# EAGLE design PowerManagementMysensors (EAGLE 6.5.0)
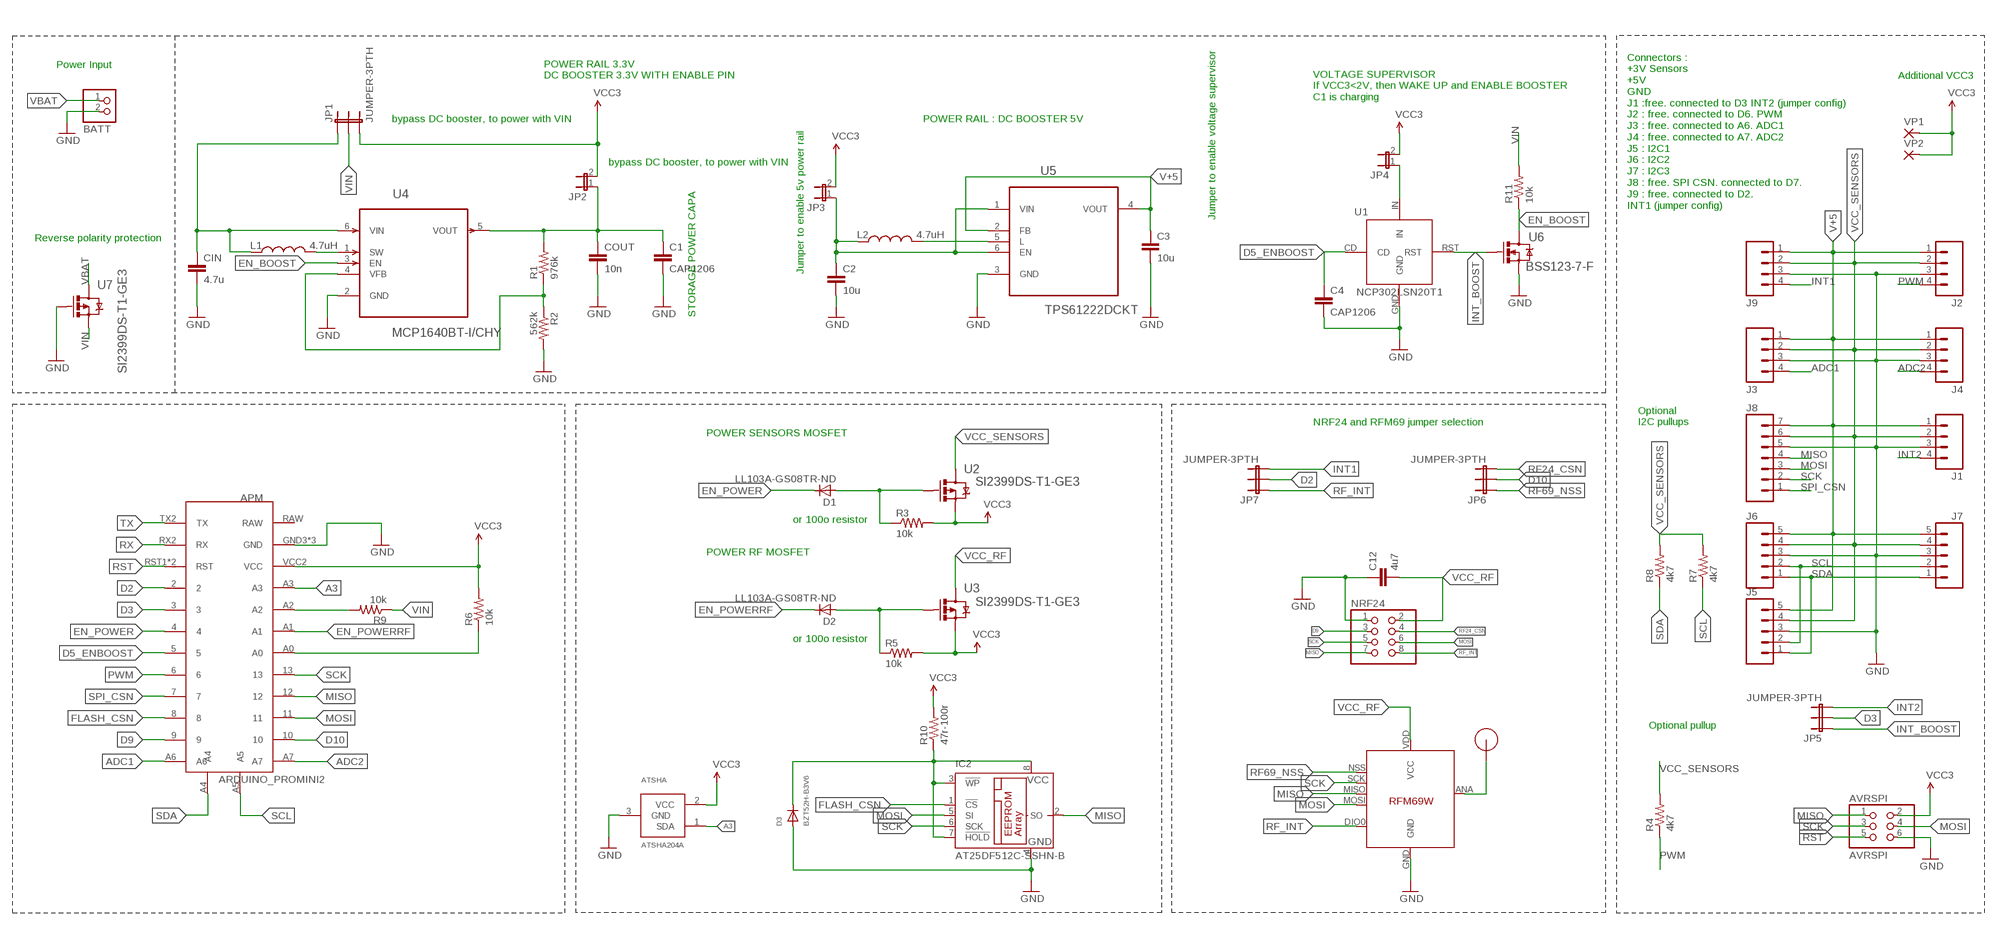
[diagram p0: schematic, sheet 1]

## Parts
ANT  RFM12B_ANTENNA  [RFM12B-ANTENNA]
APM  ARDUINO_PROMINI2  [ARDUINO_PROMINI2]
ATSHA  ATSHA204A  [SOT23]
AVRSPI  AVRSPI  PINHD-2X3  [2X03]
BATT  JST_2PIN-THM  [JST-PH-2-THM]
C1  CAP1206  [CAP1206]
C2  10u  CAP1206  [CAP1206]
C3  10u  CAP1206  [CAP1206]
C4  CAP1206  [CAP1206]
C12  4u7  CAP1206  [CAP1206]
CIN  4.7u  CAP1206  [CAP1206]
COUT  10n  CAP1206  [CAP1206]
D1  LL103A-GS08TR-ND  D-SOD-80  [SOD80]
D2  LL103A-GS08TR-ND  D-SOD-80  [SOD80]
D3  BZT52H-B3V6  DIODESOD-123  [SOD-123]
IC2  AT25DF512C-SSHN-B  25AA080SN  [SO-08]
J1  M041X04_NO_SILK  [1X04_NO_SILK]
J2  M041X04_NO_SILK  [1X04_NO_SILK]
J3  M041X04_NO_SILK  [1X04_NO_SILK]
J4  M041X04_NO_SILK  [1X04_NO_SILK]
J5  M05NO_SILK  [1X05_NO_SILK]
J6  M05NO_SILK  [1X05_NO_SILK]
J7  M05NO_SILK  [1X05_NO_SILK]
J8  M07  [1X07]
J9  M041X04_NO_SILK  [1X04_NO_SILK]
JP1  JUMPER-3PTH  [1X03]
JP2  JUMPER-2PTH  [1X02]
JP3  JUMPER-2PTH  [1X02]
JP4  JUMPER-2PTH  [1X02]
JP5  JUMPER-3PTH  [1X03]
JP6  JUMPER-3PTH  [1X03]
JP7  JUMPER-3PTH  [1X03]
L1  4.7uH  INDUCTOR0805  [0805]
L2  4.7uH  INDUCTOR0805  [0805]
NRF24  PINHD-2X4  [2X04]
R1  976k  RESISTOR1206  [1206]
R2  562k  RESISTOR1206  [1206]
R3  10k  RESISTOR1206  [1206]
R4  4k7  RESISTOR1206  [1206]
R5  10k  RESISTOR1206  [1206]
R6  10k  RESISTOR1206  [1206]
R7  4k7  RESISTOR1206  [1206]
R8  4k7  RESISTOR1206  [1206]
R9  10k  RESISTOR1206  [1206]
R10  47r-100r  RESISTOR1206  [1206]
R11  10k  RESISTOR1206  [1206]
RFM69  RFM69  [RFM69W-MINPADS]
U1  NCP302LSN20T1  [NCP302LSN20T1]
U2  SI2399DS-T1-GE3  [SOT95P237X112-3N]
U3  SI2399DS-T1-GE3  [SOT95P237X112-3N]
U4  MCP1640BT-I/CHY  [SOT95P270X145-6N]
U5  TPS61222DCKT  [SOT65P210X110-6N]
U6  BSS123-7-F  [SOT95P240X110-3N]
U7  SI2399DS-T1-GE3  [SOT95P237X112-3N]
VP1  1,6/0,9  [1,6/0,9]
VP2  1,6/0,9  [1,6/0,9]

## Nets
A3: APM.A3 ATSHA.1(SDA)
ADC1: APM.A6 J3.4
ADC2: APM.A7 J4.4
D2: APM.2 JP7.2
D3: APM.3 JP5.2
D5_ENBOOST: APM.5 C4.1 U1.CD
D9: APM.9 NRF24.3
D10: APM.10 JP6.2
EN_BOOST: R11.1 U4.3(EN) U6.3(D)
EN_POWER: APM.4 D1.1(C)
EN_POWERRF: APM.A1 D2.1(C)
FLASH_CSN: APM.8 IC2.1(!CS)
GND: APM.GND3(GND) APM.GND4(GND) APM.GND5(GND) ATSHA.3(GND) AVRSPI.6 BATT.2 C1.2 C2.2 C3.2 C4.2 C12.1 CIN.2 COUT.2 D3.A IC2.4(GND) J1.3 J2.3 J3.3 J4.3 J5.3 J6.3 J7.3 J8.5 J9.3 NRF24.1 R2.2 RFM69.GND U1.GND U4.2(GND) U5.3(GND) U6.2(S) U7.1(G)
INT1: J9.4 JP7.3
INT2: J1.4 JP5.3
INT_BOOST: JP5.1 U1.RST U6.1(G)
MISO: APM.12 AVRSPI.1 IC2.2(SO) J8.4 NRF24.7 RFM69.MISO
MOSI: APM.11 AVRSPI.4 IC2.5(SI) J8.3 NRF24.6 RFM69.MOSI
N$1: L1.2 U4.1(SW)
N$2: ANT.P$1 RFM69.ANA(ANT)
N$3: JP4.1 U1.IN
N$4: R1.1 R2.1 U4.4(VFB)
N$6: D3.C IC2.3(!WP) IC2.7(!HOLD) IC2.8(VCC) R10.1
N$7: D1.2(A) R3.1 U2.1(G)
N$8: C1.1 COUT.1 JP2.1 R1.2 U4.5(VOUT)
N$10: L2.2 U5.5(L)
N$11: APM.A0 R6.1
N$13: C2.1 JP3.1 L2.1 U5.1(VIN) U5.6(EN)
N$14: APM.A2 R9.2
N$18: D2.2(A) R5.1 U3.1(G)
PWM: APM.6 J2.4 R4.1
RF24_CSN: JP6.3 NRF24.4
RF69_NSS: JP6.1 RFM69.NSS(SEL)
RF_INT: JP7.1 NRF24.8 RFM69.DIO0
RST: APM.RST1(RST) APM.RST2(RST) AVRSPI.5
RX: APM.RX2(RX)
SCK: APM.13 AVRSPI.3 IC2.6(SCK) J8.2 NRF24.5 RFM69.SCK
SCL: APM.A5 J5.2 J6.2 J7.2 R7.1
SDA: APM.A4 J5.1 J6.1 J7.1 R8.1
SPI_CSN: APM.7 J8.1
TX: APM.TX2(TX)
V+5: C3.1 J1.1 J2.1 J3.1 J4.1 J5.5 J6.5 J7.5 J8.7 J9.1 U5.2(FB) U5.4(VOUT)
VBAT: BATT.1 U7.3(D)
VCC: APM.VCC2(VCC) ATSHA.2(VCC) AVRSPI.2 JP1.3 JP2.2 JP3.2 JP4.2 R3.2 R5.2 R6.2 R10.2 U2.2(S) U3.2(S) VP1.1(P) VP2.1(P) ; supply symbol labelled VCC3
VCC_RF: C12.2 NRF24.2 RFM69.VDD(VCC) U3.3(D)
VCC_SENSORS: J1.2 J2.2 J3.2 J4.2 J5.4 J6.4 J7.4 J8.6 J9.2 R4.2 R7.2 R8.2 U2.3(D)
VIN: JP1.2 R9.1 R11.2 U7.2(S)
VIN2: CIN.1 JP1.1 L1.1 U4.6(VIN)
Unconnected: APM.RAW

## Notes on the sheet
- Power Input
- POWER RAIL 3.3V
  DC BOOSTER 3.3V WITH ENABLE PIN
- Additional VCC3
- VOLTAGE SUPERVISOR
  If VCC3<2V, then WAKE UP and ENABLE BOOSTER
  C1 is charging
- bypass DC booster, to power with VIN | POWER RAIL : DC BOOSTER 5V
- bypass DC booster, to power with VIN
- Connectors :
  +3V Sensors
  +5V
  GND
  J1 :free. connected to D3 INT2 (jumper config)
  J2 : free. connected to D6. PWM
  J3 : free. connected to A6. ADC1
  J4 : free. connected to A7. ADC2
  J5 : I2C1
  J6 : I2C2
  J7 : I2C3
  J8 : free. SPI CSN. connected to D7.
  J9 : free. connected to D2. 
  INT1 (jumper config)
- Jumper to enable voltage supervisor
- Reverse polarity protection
- Jumper to enable 5v power rail
- STORAGE POWER CAPA
- NRF24 and RFM69 jumper selection
- Optional 
  I2C pullups
- POWER SENSORS MOSFET
- or 100o resistor
- POWER RF MOSFET
- or 100o resistor
- Optional pullup

## Library data of the parts
ANT = LowPowerLab:RFM12B_ANTENNA
APM = pmo_lib:ARDUINO_PROMINI2
ATSHA = Sensor_tbowmo:ATSHA204A
AVRSPI = pinhead:PINHD-2X3: PIN HEADER
BATT = adafruit:JST_2PIN: JST 2-Pin Connectors of various flavors SMT-RA (S2B-PH-SM4) 4UConnector #17311 SMT (B2B-PH-SM4) THM-RA (S2B-PH) THM (B2B-PH)
C1-C4 C12 CIN COUT = SparkFun-Passives:CAP1206
D1 D2 = semicon-smd-ipc:D-: DIODE unfilled
D3 = adafruit:DIODE: Diode SMADIODE - SMA Surface Mount Package 20V 1A Schottky Diode Digikey: 641-1014-6-ND DO-1N4148 - Through Hole Small Current Diode SOD-123 20V 1 A (.5mV Vf) Schottky Diode - Digikey: MBRX120TPMSCT-ND SOD-323 10V 570mA (.38mV Vf, 3ns) Schottky Diode - Digikey: ZLLS410CT-ND SOD-523 30V 30mA Schottky Diode (RB751S-40TE61) - Digikey: RB751S-40TE61CT-ND SOT23-R/W - SOT23 Package (R = Solder Paste/Reflow Ovens, W = Hand-Soldering) BAT54Film 40V 300mA - Digikey: 497-7162-1-ND
IC2 = microchip:25*: Serial EEPROM 4K/ 8K , SPI bus; MF: MICROCHIP; MPN: 25AA080/SN; OC_FARNELL: 1816072; OC_NEWARK: 92C7351
J1-J4 J9 = SparkFun-Connectors:M04: Header 4 Standard 4-pin 0.1" header. Use with straight break away headers (SKU : PRT-00116), right angle break away headers (PRT-00553), swiss pins (PRT-00743), machine pins (PRT-00117), and female headers (PRT-00115). Molex polarized connector foot print use with SKU : PRT-08231 with associated crimp pins and housings. 1MM SMD Version SKU: PRT-10208
J5-J7 = SparkFun-Connectors:M05: Header 5 Standard 5-pin 0.1" header. Use with straight break away headers (SKU : PRT-00116), right angle break away headers (PRT-00553), swiss pins (PRT-00743), machine pins (PRT-00117), and female headers (PRT-00115). Molex polarized connector foot print use with SKU : PRT-08230 with associated crimp pins and housings.
J8 = SparkFun-Connectors:M07: Header 7 Standard 7-pin 0.1" header. Use with straight break away headers (SKU : PRT-00116), right angle break away headers (PRT-00553), swiss pins (PRT-00743), machine pins (PRT-00117), and female headers (PRT-00115). NOTES ON THE VARIANTS LOCK and LOCK_LONGPADS... This footprint was designed to help hold the alignment of a through-hole component (i.e. 7-pin header) while soldering it into place. You may notice that each hole has been shifted either up or down by 0.005 of an inch from it's more standard position (which is usually a perfectly straight line). This slight alteration caused the pins (the squares in the middle) to touch the edges of the holes. Because they are alternating, it causes a "brace" to hold the header in place. 0.005 has proven to be the perfect amount of "off-center" position when using our standard breakaway headers. Although looks a little odd when you look at the bare footprint, once you have a header in there, the alteration is very hard to notice. Also, if you push a header all the way into place, it is covered up entirely on the bottom side. This idea of altering the position of holes to aid alignment will be further integrated into the Sparkfun Library for other footprints. It can help hold any component with 3 or more connection pins.
JP1 JP5-JP7 = SparkFun-Passives:JUMPER-3
JP2-JP4 = SparkFun-Passives:JUMPER-2: Jumper Basic 0.1" spaced jumper. Use with breakaway headers.
L1 L2 = SparkFun-Passives:INDUCTOR: Inductors Basic Inductor/Choke - 0603 and 1206. Footprints are not proven and vary greatly between part numbers. SRN6045- 33uH, 20% 1.4A SDR0403-560KL - 56uH, 10%, 500mA RMS/740mA peak
NRF24 = pinhead:PINHD-2X4: PIN HEADER
R1-R11 = SparkFun-Passives:RESISTOR: Resistor Basic schematic elements and footprints for 0603, 1206, and PTH resistors.
RFM69 = LowPowerLab:RFM69
U1 = pmo_lib:NCP302LSN20T1
U2 U3 U7 = pmo_lib:SI2399DS-T1-GE3: P-Channel 20-V (D-S) MOSFET; MPN: SI2399DS-T1-GE3; OC_FARNELL: 2056681; OC_NEWARK: 64T4058; PACKAGE: SOT-23-3; SUPPLIER: VISHAY SILICONIX
U4 = pmo_lib:MCP1640BT-I/CHY: Synchronous Boost Regulator; MPN: MCP1640BT-I/CHY; OC_FARNELL: 1800207; OC_NEWARK: 73R3625; PACKAGE: SOT-6; SUPPLIER: Microchip
U5 = pmo_lib:TPS61222DCKT: LOW INPUT VOLTAGE STEP-UP CONVERTER; MPN: TPS61222DCKT; OC_FARNELL: 1755643; OC_NEWARK: 94T5101; PACKAGE: SC70-6; SUPPLIER: Texas Instruments
U6 = pmo_lib:BSS123-7-F: MODE FIELD EFFECT TRANSISTOR; MPN: BSS123-7-F; OC_FARNELL: 1843725; OC_NEWARK: 12T1440; PACKAGE: SOT-23-3; SUPPLIER: DIODES INC.
VP1 VP2 = wirepad:1,6/0,9: THROUGH-HOLE PAD

## Net classes
1 Power: width 0.406 mm

## Board
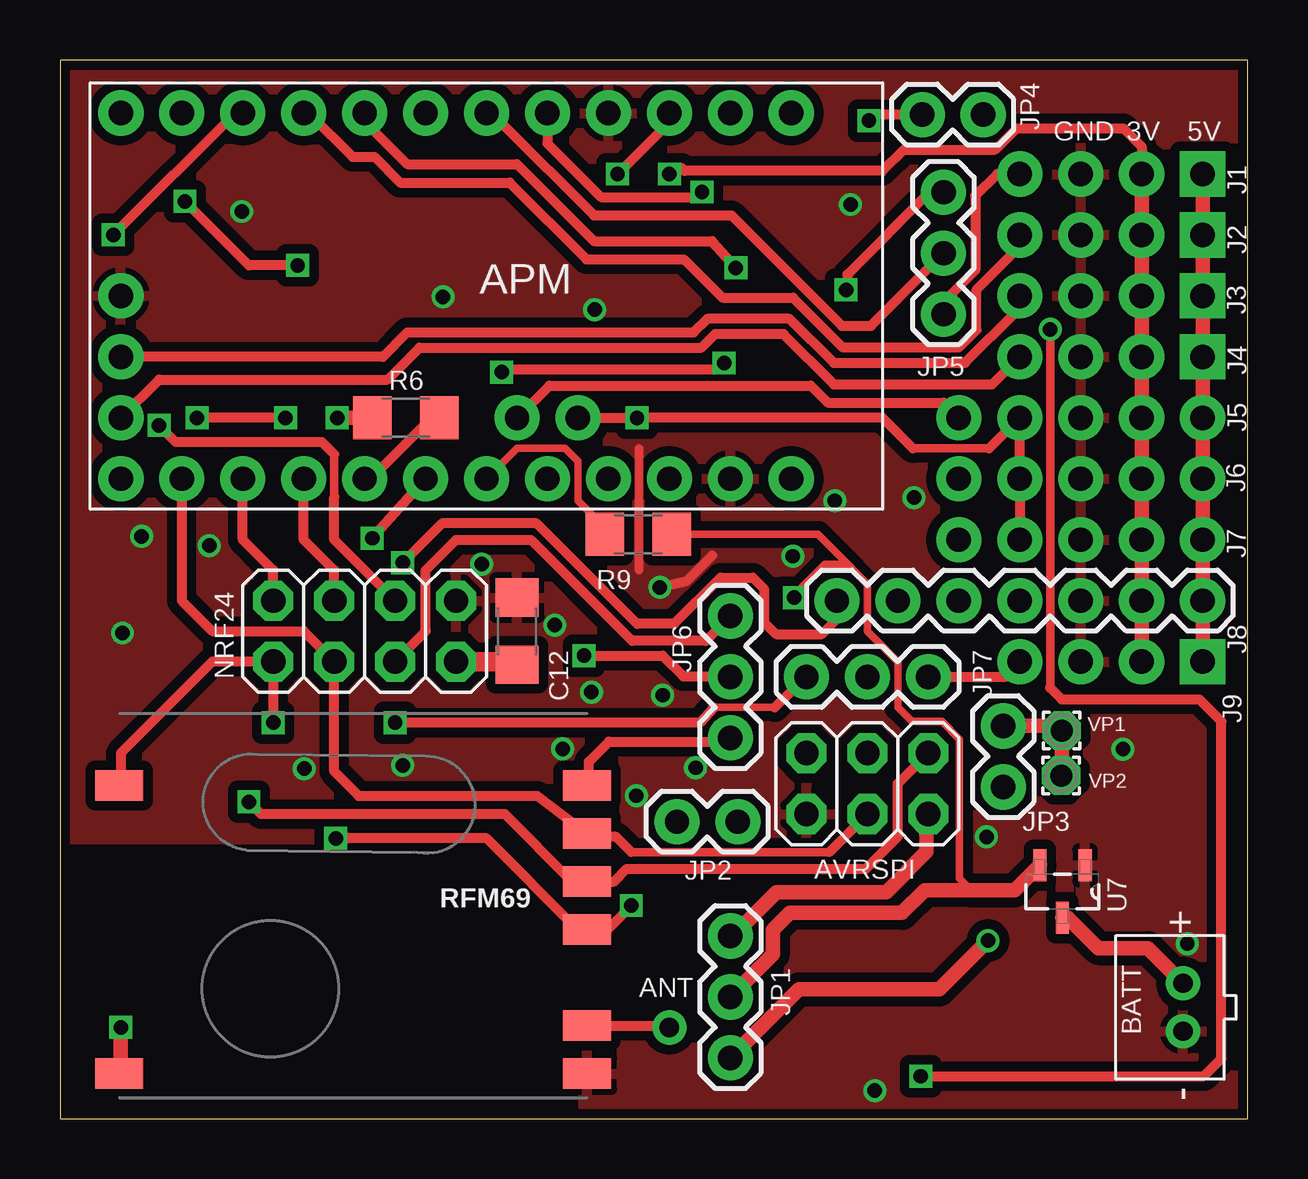
[diagram p1: board, top side]
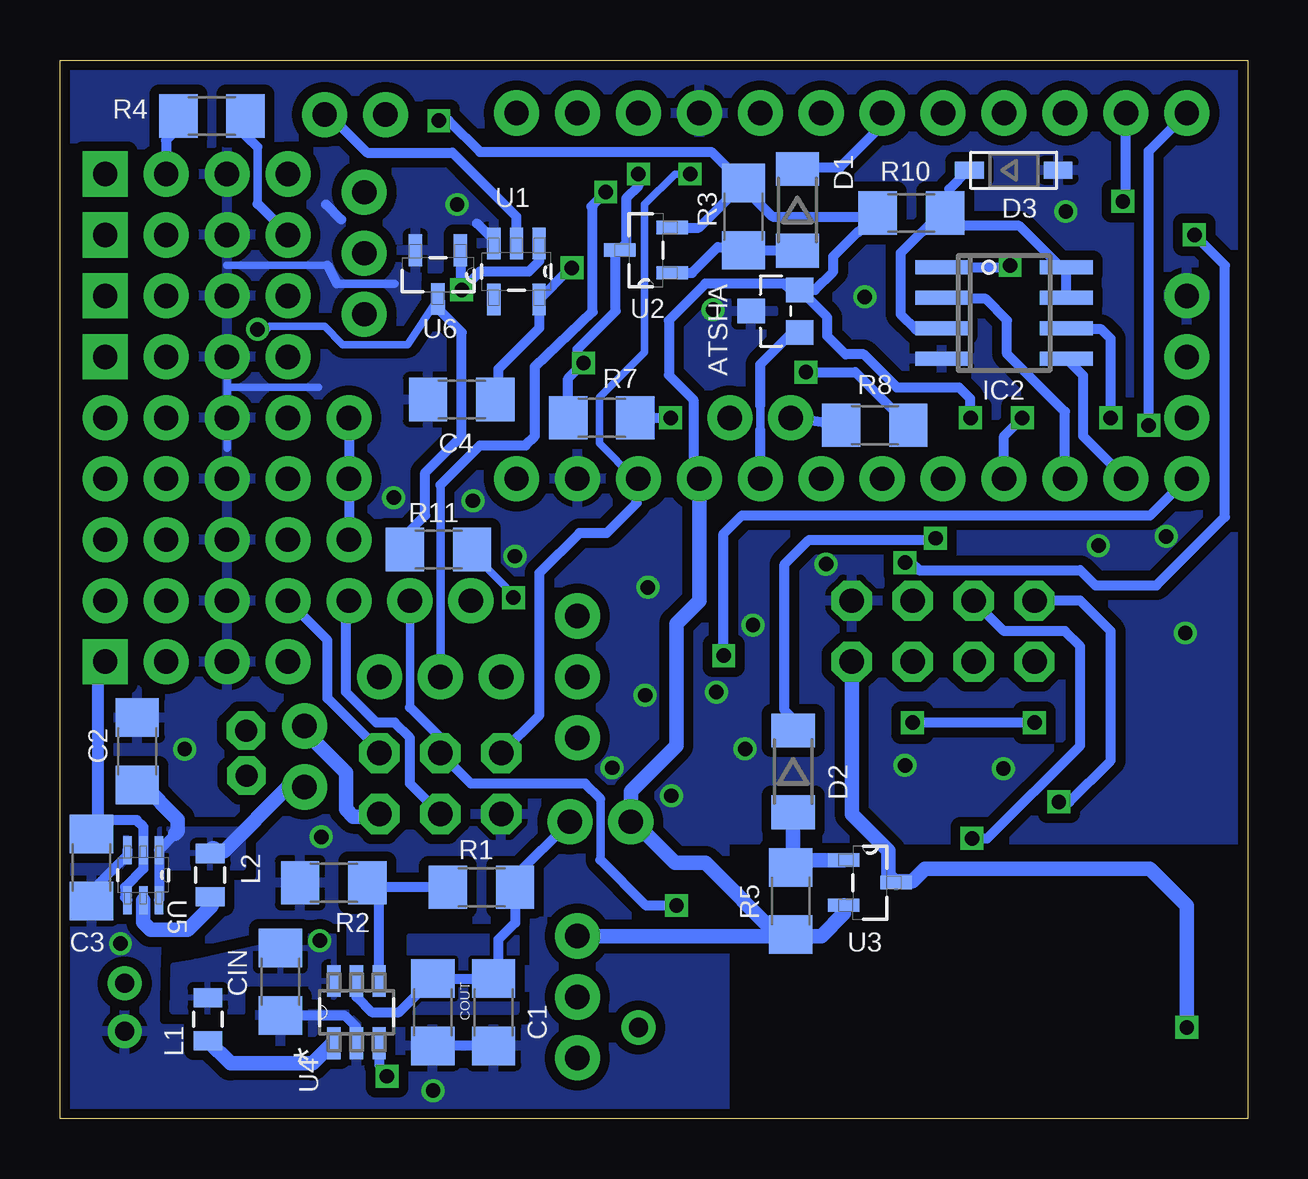
[diagram p2: board, bottom side, seen from below]

Size 49.51 x 44.12 mm. Coordinates in mm from the lower left corner, seen from the top.
Outline: 0,0 49.51,0 49.51,44.12 0,44.12 0,0
Copper layers (1*16): Top 0.0356mm / dielectric 1.5011mm / Bottom 0.0356mm
Design rules "LaenPCBOrder": minimum track width 6mil, minimum drill 13mil, track to track 6mil, track to pad 6mil, pad to pad 6mil, via to via 6mil, smd to smd 6mil, copper to edge 15mil, drill to drill 6mil, minimum pad ring 7mil, minimum via ring 7mil, stop-mask expansion 3mil, vias tented up to drill 0mil, thermal gap 10mil

### Footprints (pad centres in the part's own frame; a part is rotated, then mirrored left to right if it is on the bottom)
RFM12B-ANTENNA = drill 0.8 pad 1.422: P$1 0,0
ARDUINO_PROMINI2 = drill 1.016 pad 1.88: 2 -7.62,2.54; 3 -7.62,0; 4 -7.62,-2.54; 5 -7.62,-5.08; 6 -7.62,-7.62; 7 -7.62,-10.16; 8 -7.62,-12.7; 9 -7.62,-15.24; 10 7.62,-15.24; 11 7.62,-12.7; 12 7.62,-10.16; 13 7.62,-7.62; A0 7.62,-5.08; A1 7.62,-2.54; A2 7.62,0; A3 7.62,2.54; A4 5.08,1.27; A5 5.08,3.81; A6 2.54,-15.24; A7 5.08,-15.24; GND3 -7.62,5.08; GND4 7.62,10.16; GND5 0,-15.24; RAW 7.62,12.7; RST1 -7.62,7.62; RST2 7.62,7.62; RX2 -7.62,10.16; TX2 -7.62,12.7; VCC2 7.62,5.08
SOT23 = smd 1.016 x 1.143: 1 -0.889,-1.016; 2 0.889,-1.016; 3 0,1.016
2X03 = drill 1.016 pad 1.676 octagon: 1 -2.54,-1.27; 2 -2.54,1.27; 3 0,-1.27; 4 0,1.27; 5 2.54,-1.27; 6 2.54,1.27
JST-PH-2-THM = drill 0.8 pad 1.422: 1 1,0; 2 -1,0
CAP1206 = smd 1.6 x 1.8: 1 -1.4,0; 2 1.4,0
SOD80 = smd 1.4 x 1.8: 1 -1.7,0; 2 1.7,0
SOD-123 = smd 1.2 x 0.7: A 1.85,0; C -1.85,0
SO-08 = smd 0.6 x 2.2: 1 -1.905,-2.6; 2 -0.635,-2.6; 3 0.635,-2.6; 4 1.905,-2.6; 5 1.905,2.6; 6 0.635,2.6; 7 -0.635,2.6; 8 -1.905,2.6
1X04_NO_SILK = drill 1.016 pad 1.88 square: 1 0,0 | drill 1.016 pad 1.88: 2 2.54,0; 3 5.08,0; 4 7.62,0
1X05_NO_SILK = drill 1.016 pad 1.88: 1 0,0; 2 2.54,0; 3 5.08,0; 4 7.62,0; 5 10.16,0
1X07 = drill 1.016 pad 1.88: 1 0,0; 2 2.54,0; 3 5.08,0; 4 7.62,0; 5 10.16,0; 6 12.7,0; 7 15.24,0
1X03 = drill 1.016 pad 1.88: 1 0,0; 2 2.54,0; 3 5.08,0
1X02 = drill 1.016 pad 1.88: 1 0,0; 2 2.54,0
0805 = smd 0.8 x 1.2: 1 -0.9,0; 2 0.9,0
2X04 = drill 1.016 pad 1.676 octagon: 1 -3.81,-1.27; 2 -3.81,1.27; 3 -1.27,-1.27; 4 -1.27,1.27; 5 1.27,-1.27; 6 1.27,1.27; 7 3.81,-1.27; 8 3.81,1.27
1206 = smd 1.6 x 1.8: 1 -1.4,0; 2 1.4,0
RFM69W-MINPADS = smd 2 x 1.27: ANA 8,-5; DIO0 -11.5,5; GND 8,-7; MISO 8,1; MOSI 8,3; NSS 8,5; SCK 8,-1; VDD -11.5,-7
NCP302LSN20T1 = smd 1.321 x 0.559: CD 1.168,0.94; GND -1.168,-0.94; IN -1.168,0; NC 1.168,-0.94; RST -1.168,0.94
SOT95P237X112-3N = smd 1.321 x 0.559: 1 -1.092,0.94; 2 -1.092,-0.94; 3 1.092,0
SOT95P270X145-6N = smd 1.321 x 0.559: 1 -1.295,0.94; 2 -1.295,0; 3 -1.295,-0.94; 4 1.295,-0.94; 5 1.295,0; 6 1.295,0.94
SOT65P210X110-6N = smd 1.168 x 0.356: 1 -1.041,0.66; 2 -1.041,0; 3 -1.041,-0.66; 4 1.041,-0.66; 5 1.041,0; 6 1.041,0.66
SOT95P240X110-3N = smd 1.321 x 0.559: 1 -1.016,0.94; 2 -1.016,-0.94; 3 1.016,0
1,6/0,9 = drill 0.914 pad 1.6 octagon: 1 0,0

### Placement (x,y rotation side)
ANT  25.4,3.81 0 top
APM  17.78,34.29 270 top
ATSHA  19.68,33.66 90 bottom
AVRSPI  33.66,13.97 180 top
BATT  46.81,4.65 90 top
C1  31.43,4.45 270 bottom
C2  46.29,15.32 90 bottom
C3  48.2,10.48 270 bottom
C4  32.77,29.97 180 bottom
C12  19.05,20.32 270 top
CIN  40.32,5.71 270 bottom
COUT  33.97,4.45 270 bottom
D1  18.77,37.87 270 bottom
D2  18.95,14.48 270 bottom
D3  9.75,39.52 0 bottom
IC2  10.16,33.58 270 bottom
J1  47.62,39.37 180 top
J2  47.62,36.83 180 top
J3  47.62,34.29 180 top
J4  47.62,31.75 180 top
J5  37.47,29.21 0 top
J6  37.47,26.67 0 top
J7  37.47,24.13 0 top
J8  32.38,21.59 0 top
J9  47.62,19.05 180 top
JP1  27.94,2.54 90 top
JP2  28.26,12.38 180 top
JP3  39.32,13.83 90 top
JP4  38.48,41.85 180 top
JP5  36.83,38.61 270 top
JP6  27.94,15.88 90 top
JP7  31.11,18.41 0 top
L1  43.35,4.15 270 bottom
L2  43.24,10.16 270 bottom
NRF24  12.7,20.32 180 top
R1  31.94,9.65 0 bottom
R2  38.1,9.84 180 bottom
R3  21.02,37.59 90 bottom
R4  43.18,41.78 180 bottom
R5  19.05,9.08 270 bottom
R6  14.41,29.21 180 top
R7  26.92,29.21 180 bottom
R8  15.54,28.91 0 bottom
R9  24.1,24.36 180 top
R10  14.02,37.74 180 bottom
R11  33.73,23.72 0 bottom
RFM69  13.97,8.89 0 top
U1  30.48,35.31 270 bottom
U2  25.08,36.2 180 bottom
U3  15.75,9.84 0 bottom
U4  37.15,4.45 90 bottom
U5  46.04,10.16 270 bottom
U6  33.76,35.18 270 bottom
U7  41.78,9.47 270 top
VP1  41.76,16.18 90 top
VP2  41.73,14.3 90 top

### Tracks (layer width: path | path; a pad name or v marks a point on that pad's centre or on a via)
A3
  Bottom 0.356: 20.32,28.7 20.32,29.72
  Bottom 0.406: ATSHA.1 18.99,32.77 20.32,31.43 20.32,29.72 | APM.A3 20.32,28.7
ADC1
  Top 0.406: APM.A6 13.46,31.75 14.48,32.77 26.42,32.77 26.99,33.34 30.42,33.34 32.26,31.5 37.72,31.5 39.88,33.66 39.88,34.16 J3.4
ADC2
  Top 0.406: APM.A7 4.13,30.8 13.65,30.8 14.99,32.13 26.73,32.13 27.3,32.7 30.16,32.7 32.26,30.61 38.86,30.61 J4.4
D2  (via drill 0.6)
  Top 0.406: APM.2 20.32,40.64 22.55,38.41 26.54,38.41 v26.76,38.62
  Bottom 0.356: JP7.2 33.66,26.42
  Bottom 0.406: v26.76,38.62 27.36,38.02 27.3,38.02 27.3,33.63 29.72,31.34 29.72,28.45 30.1,28.07 32,28.07 33.66,26.42
D3
  Top 0.406: APM.3 18.24,41.45 18.44,41.45 22.25,37.64 27.99,37.64 32.59,33.05 33.81,33.05 JP5.2
D5_ENBOOST  (via drill 0.6)
  Top 0.406: APM.5 12.7,41.55 14.48,39.78 19.05,39.78 22.25,36.58 27.18,36.58 v28.17,35.46
  Bottom 0.406: v28.17,35.46 28.3,35.33 28.35,35.33 U1.CD 29.54,32.94 31.24,31.24 31.24,30.1 C4.1
D9  (via drill 0.6)
  Top 0.356: 11.43,25.91 11.43,27.69
  Top 0.406: NRF24.3 11.43,24.13 11.43,25.91 | 11.43,27.69 10.92,28.19 4.83,28.19 v4.13,28.89
  Bottom 0.406: v4.13,28.89 4.13,40.32 APM.9
D10  (via drill 0.6)
  Top 0.406: v21.84,19.3 25.12,19.3 25.98,18.44 27.91,18.44 JP6.2
  Bottom 0.406: APM.10 4.06,25.15 21.08,25.15 21.84,24.38 v21.84,19.3
EN_BOOST  (via drill 0.6)
  Top 0.356: v41.27,32.89 41.27,17.97
  Top 0.406: v35.88,1.78 47.68,1.78 48.41,2.52 48.41,16.56 47.5,17.48 41.76,17.48 41.27,17.96 41.27,17.97
  Bottom 0.305: v41.27,32.89 40.89,32.89 40.77,33.02 38.48,33.02 37.72,32.26 35.03,32.26 U6.3
  Bottom 0.406: U4.3 36.21,2.23 v35.88,1.78 | R11.1 35.13,24.3 34.29,25.15 34.29,26.92 32.77,28.45 32.77,32.77 33.66,33.66 33.66,34.06 U6.3
EN_POWER
  Bottom 0.406: APM.4 15.24,41.4 17.02,39.62 18.72,39.62 D1.1
EN_POWERRF  (via drill 0.6)
  Top 0.406: APM.A1 v13.02,24.19
  Bottom 0.406: D2.1 18.95,16.66 19.3,17.02 19.3,23.11 18.29,24.13 13.08,24.13 v13.02,24.19
FLASH_CSN  (via drill 0.6)
  Top 0.406: v9.91,35.56 7.87,35.56 v5.21,38.23
  Bottom 0.406: APM.8 5.08,38.35 v5.21,38.23 | IC2.1 10.36,35.48 v9.91,35.56
GND  (via drill 0.6)
  Top 0.356: 24.13,27.94 24.13,22.86
  Top 0.406: v25.01,22.15 26.14,22.43 27.18,23.47
  Bottom 0.305: 38.35,35.56 42.57,35.56 | C4.2 34.8,29.97 | 42.55,30.48 38.73,30.48 | 42.55,27.94 J4.3
  Bottom 0.356: 37.97,34.8 35.56,34.8
  Bottom 0.406: CIN.2 37.65,4.32 37.15,3.81 U4.2 | C1.2 COUT.2 | 37.78,37.47 38.42,38.1 | U5.3 46.7,10.99 48.06,9.63 48.06,9.22 C3.2 | U1.GND 31.42,36.6 32.13,37.31 | 38.35,35.56 37.97,34.8
  other vias: 33.96,1.18 46.99,7.3 44.31,15.41 32.96,38.1 15.96,34.25 22.29,33.72 10.19,14.59 14.29,14.73 38.62,11.75 3.4,24.27 32.3,25.76 6.22,23.89 25.12,17.65 22.15,17.78 24.03,13.46 26.49,14.63 30.54,23.44 2.6,20.24 35.6,25.88 20.95,15.42 20.62,20.57 17.58,23.11 7.58,37.81
  pour Bottom (isolate 0.406, rank 6): -3.81,48.26 54.61,48.26 54.61,-5.08 -3.81,-5.08
  pour Top (isolate 0.406, rank 6): -1.27,45.72 52.07,45.72 52.07,-2.54 -1.27,-2.54
INT1
  Top 0.406: JP7.3 39.37,18.41 J9.4
INT2
  Top 0.406: J1.4 39.06,39.37 38.15,38.46 38.15,35.36 36.83,34.04 JP5.3
INT_BOOST  (via drill 0.6)
  Top 0.406: 36.75,38.73 JP5.1 36.25,38.61 32.82,35.18 32.82,34.59 v32.77,34.54
  Bottom 0.406: U1.RST 29.54,35.74 29.97,35.31 32,35.31 v32.77,34.54 32.82,34.59 U6.1
MISO  (via drill 0.6)
  Top 0.406: NRF24.7 8.89,22.86 7.62,24.13 APM.12 | AVRSPI.1 34.92,13.97 34.92,11.75 33.59,10.41 23.62,10.41 23.1,9.89 RFM69.MISO 21.35,9.89 18.54,12.7 8.38,12.7 v7.87,13.21
  Bottom 0.406: NRF24.7 6.99,21.59 5.71,20.32 5.71,14.92 7.43,13.21 v7.87,13.21 | AVRSPI.1 36.2,15.37 38.35,17.53 38.35,19.94 J8.4 | APM.12 7.62,29.46 10.03,31.88 10.03,33.27 10.92,34.16 12.71,34.16 IC2.2
MOSI
  Top 0.356: 32.07,11.11 23.81,11.11
  Top 0.406: AVRSPI.4 32.07,11.11 | 22.14,12.06 RFM69.MOSI | 23.81,11.11 23.18,11.75 22.11,11.75 RFM69.MOSI | APM.11 5.08,21.59 6.35,20.32 10.16,20.32 NRF24.6 11.43,14.48 12.45,13.46 19.89,13.46 RFM69.MOSI
  Bottom 0.305: APM.11 5.08,26.72
  Bottom 0.406: AVRSPI.4 34.92,13.97 34.92,15.88 35.56,16.51 36.32,16.51 37.59,17.78 37.59,21.46 J8.3 | 5.08,26.72 5.13,26.72 6.86,28.45 6.86,30.97 IC2.5
N$1
  Bottom 0.61: U4.1 38.15,3.15 38.99,2.31 42.4,2.31 L1.2
N$2
  Top 0.406: RFM69.ANA 25.32,3.89 ANT.P$1
N$3
  Bottom 0.406: U1.IN 30.48,37.59 33.15,40.26 36.7,40.26 38.29,41.85 JP4.1
N$4
  Bottom 0.406: R1.1 36.51,9.65 R2.1 36.21,9.35 U4.4
N$6
  Bottom 0.406: IC2.8 IC2.7 7.56,35.25 9.53,37.21 12.09,37.21 R10.1 | D3.C 11.66,39.52 12.45,38.73 12.45,37.92 R10.1 | R10.1 12.8,37.74 14.48,36.07 14.48,33.53 13.84,32.89 12.81,32.89 IC2.3
N$7
  Bottom 0.406: 24.45,35.24 24,35.24 U2.1 23.16,35.26 22.1,36.32 21.15,36.32 R3.1 21,36.17 D1.2
N$8
  Bottom 0.406: U4.5 37.15,5.08 36.51,4.45 35.37,4.45 COUT.1 | COUT.1 C1.1 31.24,6.04 31.24,7.47 30.54,8.17 R1.2 30.54,10.1 JP2.1 | COUT.1 33.97,6.22
N$10
  Bottom 0.61: U5.5 46.04,8.19 45.72,7.87 44.2,7.87 43.18,8.89 43.18,9.2 L2.2
N$11
  Top 0.406: APM.A0 12.95,26.67 15.24,28.96 15.56,28.96 R6.1
N$12
  pour Bottom: 30.48,7.62 30.48,4.45 34.92,4.45 34.92,7.62
N$13
  Bottom 0.406: U5.6 U5.1 44.7,11.87
  Bottom 0.61: C2.1 46.05,13.92 44.6,12.47 44.6,11.98 44.7,11.87 | JP3.1 39.99,13.83 42.67,11.15 43.15,11.15 L2.1
  Bottom 0.813: 43.13,11.17 L2.1
  pour Bottom: 41.91,12.06 41.88,10.46 45.31,10.46 45.34,12.06
N$14
  Top 0.305: APM.A2 19.05,27.94 21.06,27.94 21.59,27.41 21.59,25.76 22.33,25.02 22.33,24.91 R9.2
N$15
  cutout Top: 0,11.43 21.59,11.43 21.59,0 0,0
N$16
  cutout Bottom: 0,11.43 21.59,11.43 21.59,0 0,0
N$18
  Bottom 0.61: U3.1 18.75,10.78 R5.1 18.95,10.58 D2.2
PWM
  Top 0.406: APM.6 10.36,41.91 12.19,40.08 13.11,40.08 14.17,39.01 18.75,39.01 21.95,35.81 26.01,35.81 27.61,34.21 30.56,34.21 32.64,32.13 37.47,32.13 38.2,32.87 38.2,34.54 39.93,36.27 39.93,36.75 J2.4
  Bottom 0.356: 41.27,40.49 41.27,38.12
  Bottom 0.406: R4.1 41.78,40.97 41.27,40.49 | 41.27,38.12 J2.4
RF24_CSN
  Top 0.406: NRF24.4 15.24,20.32 15.24,22.86 16.51,24.13 19.63,24.13 23.85,19.91 26.92,19.91 27.71,20.7 27.71,20.73 | 27.64,20.65 27.71,20.73 | 27.71,20.73 JP6.3
RF69_NSS
  Top 0.406: RFM69.NSS 22.05,13.97 22.05,14.89 22.89,15.72 27.79,15.72 JP6.1
RF_INT  (via drill 0.6)
  Top 0.305: 27.25,17.14 29.79,17.14
  Top 0.406: RFM69.DIO0 2.54,13.96 2.54,15.24 6.35,19.05 NRF24.8 v8.89,16.51 | v13.97,16.51 26.67,16.51 27.25,17.14 | 29.79,17.14 JP7.1
  Bottom 0.406: v8.89,16.51 v13.97,16.51
RST  (via drill 0.6)
  Top 0.406: APM.RST1 25.4,41.53 v23.24,39.37
  Bottom 0.305: APM.RST2 25.55,26.67 27.03,28.14 27.03,30.07 25.15,31.95 25.15,38.1 23.88,39.37 v23.24,39.37
  Bottom 0.406: AVRSPI.5 29.53,16.83 29.53,22.75 27.86,24.41 26.72,24.41 25.48,25.65 25.48,26.59 APM.RST2
SCK  (via drill 0.6)
  Top 0.406: NRF24.5 11.43,22.86 10.16,24.13 APM.13 | v23.81,8.89 22.81,7.89 RFM69.SCK 21.57,7.89 17.78,11.68 v11.49,11.68 11.43,11.75 | v9.4,29.21 v5.71,29.21
  Bottom 0.356: 34.92,17.14 J8.2 | 26.99,10.79 26.99,13.34
  Bottom 0.406: 34.92,17.14 33.66,15.88 AVRSPI.3 32.38,13.97 27.62,13.97 26.99,13.34 | NRF24.5 10.16,20.32 7.62,20.32 6.99,19.68 6.99,15.56 10.86,11.68 v11.49,11.68 | v23.81,8.89 25.08,8.89 26.99,10.79 | APM.13 10.16,28.45 v9.4,29.21 | v5.71,29.21 5.71,32.51 6.1,32.89 7.51,32.89 IC2.6
SCL  (via drill 0.6)
  Top 0.356: 35.56,27.94 38.73,27.94
  Top 0.406: APM.A5 v24.05,29.21 34.29,29.21 35.56,27.94 | 38.73,27.94 J5.2 J6.2 J7.2
  Bottom 0.406: R7.1 v24.05,29.21
SDA
  Top 0.406: APM.A4 20.4,30.56 31.29,30.56 32,29.84 36.83,29.84 J5.1
  Bottom 0.406: R8.1 APM.A4 | J5.1 J6.1 J7.1
SPI_CSN  (via drill 0.6)
  Top 0.406: APM.7 7.3,41.91 v2.22,36.83 | v14.29,23.18 15.93,24.82 19.86,24.82 24.05,20.62 25.6,20.62 27.53,22.55 28.88,22.55 29.34,22.1 29.34,20.7 29.84,20.19 31.75,20.19 32.51,20.95 32.51,21.46 J8.1
  Bottom 0.406: v2.22,36.83 0.95,35.56 0.95,25.08 3.81,22.23 6.35,22.23 6.99,22.86 13.72,22.86 14.03,23.18 v14.29,23.18
V+5
  Top 0.61: J9.1 J8.7 J7.5 J6.5 J5.5 J4.1 J3.1 J2.1 J1.1
  Bottom 0.406: U5.4 46.8,9.22 46.8,9.65 46.04,10.41 U5.2 46.02,11.2 46.02,12.17 46.3,12.45 47.63,12.45 47.82,12.26 C3.1
  Bottom 0.457: 47.94,12.38 47.82,12.26
  Bottom 0.508: 47.94,12.38 47.94,18.73 J9.1
VBAT
  Top 0.61: U7.3 42.01,8.38 43.28,7.11 45.35,7.11 BATT.1
VCC  (via drill 0.6)
  Top 0.406: JP4.2 33.97,41.85 v33.72,41.59
  Top 0.61: R6.2 v11.56,29.21 | JP1.3 28.04,7.62 29.87,9.45 34.44,9.45 36.12,11.12 36.12,12.62 AVRSPI.2 | JP3.2 41.57,16.37 VP1.1 41.76,14.76 VP2.1
  Bottom 0.406: v11.56,29.21 11.58,29.23 11.58,30.02 12.04,30.48 14.63,30.48 16,31.85 16.76,31.85 17.53,32.61 17.53,33.4 ATSHA.2 | v33.72,41.59 33.31,41.59 32,40.29 22.36,40.29 21.63,39.57 21.59,39.57 R3.2 | 23.98,37.15 U2.2 22.88,37.13 R3.2 | 18.81,34.68 ATSHA.2 | R3.2 21.02,38.8 19.81,37.59 15.57,37.59 R10.2 16.21,36.96 16.26,36.96 17.27,35.94 17.27,35.31 18.03,34.54 ATSHA.2 | ATSHA.2 19.05,34.54 19.3,34.8 22.61,34.8 24.13,33.27 24.13,30.99 23.11,29.97 23.11,26.92 APM.VCC2
  Bottom 0.61: 25.4,12.06 JP2.2 | APM.VCC2 22.86,21.59 23.81,20.64 23.81,15.56 25.72,13.65 JP2.2 | JP1.3 19.56,7.62 | 19.56,7.62 19.11,7.62 R5.2 18.99,7.62 17.78,7.62 16.84,8.56 U3.2 | JP2.2 25.59,12.38 23.88,10.67 22.61,10.67 19.56,7.62 | 36.26,12.7 AVRSPI.2 36.3,12.6 37.29,12.6 37.59,12.9 37.59,14.43 39.32,16.15 JP3.2
VCC_RF  (via drill 0.6)
  Top 0.61: RFM69.VDD 2.54,1.89 v2.54,3.81
  Top 0.813: NRF24.2 18.92,19.05 C12.2
  Bottom 0.61: NRF24.2 16.51,12.7 14.99,11.18 14.99,10.16 U3.3 14.59,9.91 13.97,9.91 13.45,10.43 4.08,10.43 2.54,8.89 v2.54,3.81
VCC_SENSORS  (via drill 0.6)
  Top 0.406: v18.41,31.11 18.67,31.11 18.8,31.24 27.43,31.24 v27.69,31.5 | v25.4,39.37 25.65,39.37 25.91,39.62 26.04,39.5 34.29,39.5 35.18,40.39 38.99,40.39 39.88,41.27 44.32,41.27 45.09,40.51 J1.2 45.09,39.88
  Top 0.61: J9.2 J8.6 J7.4 J6.4 J5.4 J4.2 J3.2 J2.2 J1.2
  Bottom 0.406: 27.82,31.37 v27.69,31.5 | U2.3 26.35,36.02 26.35,33.66 27.94,32.07 27.94,31.75 v27.69,31.5 | R7.2 28.32,30.86 v27.69,31.5 | v18.41,31.11 16.36,31.11 R8.2 | U2.3 | v25.4,39.37 25.4,38.86 25.91,38.35 25.91,36.46 U2.3 | R4.2 44.58,41.27 45.09,40.77 J1.2
VIN  (via drill 0.6)
  Top 0.305: 32.99,22.94 33.02,22.94 31.6,24.36 R9.1 | 32.99,22.94 33.66,22.28 33.66,20.32 34.92,19.05 34.92,17.14 35.51,16.56 36.75,16.56 37.49,15.82 37.49,10.03 38,9.53 | v30.61,21.72 30.61,21.84 31.88,23.11 32.82,23.11 32.99,22.94
  Top 0.61: JP1.2 29.72,6.86 29.72,7.87 30.43,8.59 35.1,8.59 36.04,9.53 38,9.53 39.8,9.53 U7.2
  Bottom 0.305: R11.2 32.33,23.57 30.92,22.16 30.92,22.04 v30.61,21.72
VIN2  (via drill 0.6)
  Top 0.61: JP1.1 30.8,5.4 36.65,5.4 v38.68,7.43
  pour Bottom (isolate 0.406): 38.1,7.62 38.1,5.08 39.01,5.08 39.01,5.64 41.91,5.64 41.91,4.45 44.81,4.47 44.78,6.4 43.87,6.55 41.1,7.16 40.64,7.62

### Text on the board
tPlace: GND | 3V | 5V | ANT